# Altium project hjz-mitosis.PrjPcb
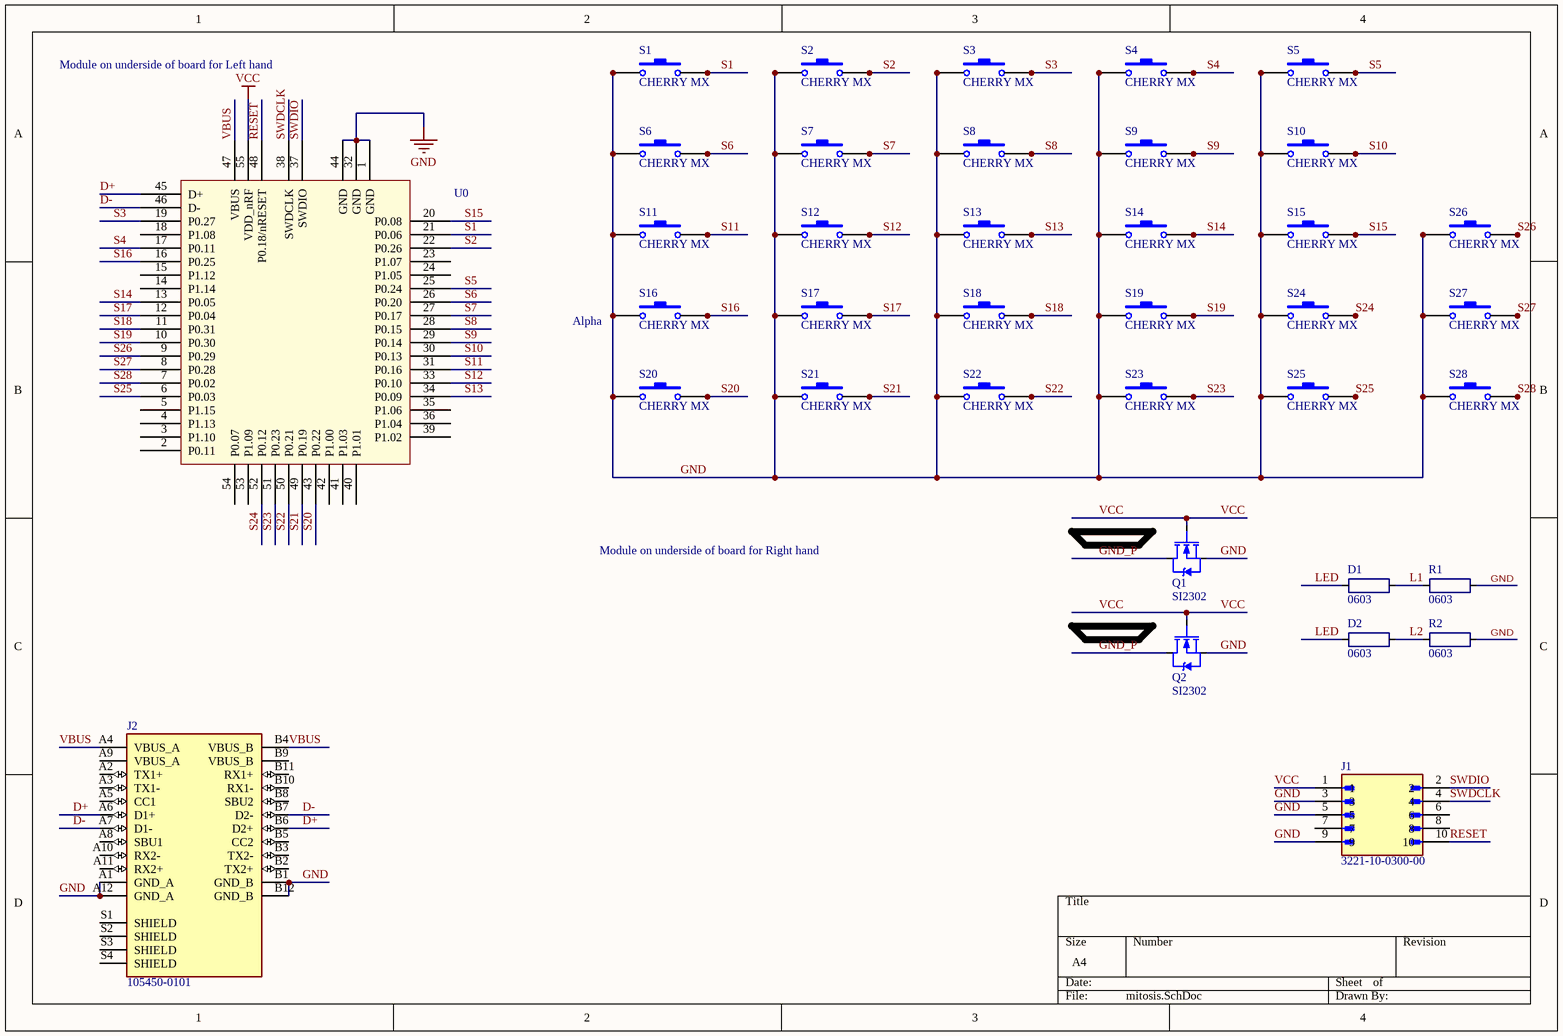
[diagram p0: mitosis.SchDoc]
1 sheet, 37 parts. Net scope: global (net labels, ports and power ports of the same name join across sheets).
Board files: mitosis.PcbDoc, mitosis_dev.PcbDoc

## Sheet mitosis.SchDoc
size A4

### Parts
D1  0603  [RESC2012X06N]
D2  0603  [RESC2012X06N]
J1  3221-10-0300-00  [CNC_3221-10-0300-00]
J2  105450-0101  [MOLEX_105450-0101]
Q1  SI2302  [SOT-23]
Q2  SI2302  [SOT-23]
R1  0603  [RESC2012X06N]
R2  0603  [RESC2012X06N]
S1  CHERRY MX  [cherry]
S2  CHERRY MX  [cherry]
S3  CHERRY MX  [cherry]
S4  CHERRY MX  [cherry]
S5  CHERRY MX  [cherry]
S6  CHERRY MX  [cherry]
S7  CHERRY MX  [cherry]
S8  CHERRY MX  [cherry]
S9  CHERRY MX  [cherry]
S10  CHERRY MX  [cherry]
S11  CHERRY MX  [cherry]
S12  CHERRY MX  [cherry]
S13  CHERRY MX  [cherry]
S14  CHERRY MX  [cherry]
S15  CHERRY MX  [cherry]
S16  CHERRY MX  [cherry]
S17  CHERRY MX  [cherry]
S18  CHERRY MX  [cherry]
S19  CHERRY MX  [cherry]
S20  CHERRY MX  [cherry]
S21  CHERRY MX  [cherry]
S22  CHERRY MX  [cherry]
S23  CHERRY MX  [cherry]
S24  CHERRY MX  [cherry]
S25  CHERRY MX  [cherry]
S26  CHERRY MX  [cherry]
S27  CHERRY MX  [cherry]
S28  CHERRY MX  [cherry]
U0  Core52840 (B)  [Core52840]  (value not drawn)

### Nets
GND: J1.3 J1.5 J1.9 J2.A1(GND_A) J2.A12(GND_A) J2.B1(GND_B) J2.B12(GND_B) Q1.2(S) Q2.2(S) R1.1 R2.1 S1.1 S1.3 S1.5 S1.7 S1.9 S1.11 S2.1 S2.3 S2.5 S2.7 S2.9 S2.11 S3.1 S3.3 S3.5 S3.7 S3.9 S3.11 S4.1 S4.3 S4.5 S4.7 S4.9 S4.11 S5.1 S5.3 S5.5 S5.7 S5.9 S5.11 S6.1 S6.3 S6.5 S6.7 S6.9 S6.11 S7.1 S7.3 S7.5 S7.7 S7.9 S7.11 S8.1 S8.3 S8.5 S8.7 S8.9 S8.11 S9.1 S9.3 S9.5 S9.7 S9.9 S9.11 S10.1 S10.3 S10.5 S10.7 S10.9 S10.11 S11.1 S11.3 S11.5 S11.7 S11.9 S11.11 S12.1 S12.3 S12.5 S12.7 S12.9 S12.11 S13.1 S13.3 S13.5 S13.7 S13.9 S13.11 S14.1 S14.3 S14.5 S14.7 S14.9 S14.11 S15.1 S15.3 S15.5 S15.7 S15.9 S15.11 S16.1 S16.3 S16.5 S16.7 S16.9 S16.11 S17.1 S17.3 S17.5 S17.7 S17.9 S17.11 S18.1 S18.3 S18.5 S18.7 S18.9 S18.11 S19.1 S19.3 S19.5 S19.7 S19.9 S19.11 S20.1 S20.3 S20.5 S20.7 S20.9 S20.11 S21.1 S21.3 S21.5 S21.7 S21.9 S21.11 S22.1 S22.3 S22.5 S22.7 S22.9 S22.11 S23.1 S23.3 S23.5 S23.7 S23.9 S23.11 S24.1 S24.3 S24.5 S24.7 S24.9 S24.11 S25.1 S25.3 S25.5 S25.7 S25.9 S25.11 S26.1 S26.3 S26.5 S26.7 S26.9 S26.11 S27.1 S27.3 S27.5 S27.7 S27.9 S27.11 S28.1 S28.3 S28.5 S28.7 S28.9 S28.11 U0.1(GND) U0.32(GND) U0.44(GND)
VCC: J1.1 Q1.1(G) Q2.1(G) U0.55(VDD_nRF)
D+: J2.A6(D1+) J2.B6(D2+) U0.45(D+)
D-: J2.A7(D1-) J2.B7(D2-) U0.46(D-)
GND_P: Q1.3(D) Q2.3(D)
L1: D1.1 R1.2
L2: D2.1 R2.2
LED: D1.2 D2.2
RESET: J1.10 U0.48(P0.18/nRESET)
S1: S1.2 S1.4 S1.6 S1.8 S1.10 S1.12 U0.21(P0.06)
S2: S2.2 S2.4 S2.6 S2.8 S2.10 S2.12 U0.22(P0.26)
S3: S3.2 S3.4 S3.6 S3.8 S3.10 S3.12 U0.19(P0.27)
S4: S4.2 S4.4 S4.6 S4.8 S4.10 S4.12 U0.17(P0.11)
S5: S5.2 S5.4 S5.6 S5.8 S5.10 S5.12 U0.25(P0.24)
S6: S6.2 S6.4 S6.6 S6.8 S6.10 S6.12 U0.26(P0.20)
S7: S7.2 S7.4 S7.6 S7.8 S7.10 S7.12 U0.27(P0.17)
S8: S8.2 S8.4 S8.6 S8.8 S8.10 S8.12 U0.28(P0.15)
S9: S9.2 S9.4 S9.6 S9.8 S9.10 S9.12 U0.29(P0.14)
S10: S10.2 S10.4 S10.6 S10.8 S10.10 S10.12 U0.30(P0.13)
S11: S11.2 S11.4 S11.6 S11.8 S11.10 S11.12 U0.31(P0.16)
S12: S12.2 S12.4 S12.6 S12.8 S12.10 S12.12 U0.33(P0.10)
S13: S13.2 S13.4 S13.6 S13.8 S13.10 S13.12 U0.34(P0.09)
S14: S14.2 S14.4 S14.6 S14.8 S14.10 S14.12 U0.13(P0.05)
S15: S15.2 S15.4 S15.6 S15.8 S15.10 S15.12 U0.20(P0.08)
S16: S16.2 S16.4 S16.6 S16.8 S16.10 S16.12 U0.16(P0.25)
S17: S17.2 S17.4 S17.6 S17.8 S17.10 S17.12 U0.12(P0.04)
S18: S18.2 S18.4 S18.6 S18.8 S18.10 S18.12 U0.11(P0.31)
S19: S19.2 S19.4 S19.6 S19.8 S19.10 S19.12 U0.10(P0.30)
S20: S20.2 S20.4 S20.6 S20.8 S20.10 S20.12 U0.43(P0.22)
S21: S21.2 S21.4 S21.6 S21.8 S21.10 S21.12 U0.49(P0.19)
S22: S22.2 S22.4 S22.6 S22.8 S22.10 S22.12 U0.50(P0.21)
S23: S23.2 S23.4 S23.6 S23.8 S23.10 S23.12 U0.51(P0.23)
S24: S24.2 S24.4 S24.6 S24.8 S24.10 S24.12 U0.52(P0.12)
S25: S25.2 S25.4 S25.6 S25.8 S25.10 S25.12 U0.6(P0.03)
S26: S26.2 S26.4 S26.6 S26.8 S26.10 S26.12 U0.9(P0.29)
S27: S27.2 S27.4 S27.6 S27.8 S27.10 S27.12 U0.8(P0.28)
S28: S28.2 S28.4 S28.6 S28.8 S28.10 S28.12 U0.7(P0.02)
SWDCLK: J1.4 U0.38(SWDCLK)
SWDIO: J1.2 U0.37(SWDIO)
VBUS: J2.A4(VBUS_A) J2.B4(VBUS_B) U0.47(VBUS)

Not connected (* = marked no-connect by the designer): J1 6 7 8; J2 A2(TX1+) A3(TX1-) A5(CC1) A8(SBU1) A9(VBUS_A) A10(RX2-) A11(RX2+) B2(TX2+) B3(TX2-) B5(CC2) B8(SBU2) B9(VBUS_B) B10(RX1-) B11(RX1+) S1(SHIELD) S2(SHIELD) S3(SHIELD) S4(SHIELD); U0 2(P0.11) 3(P1.10) 4(P1.13) 5(P1.15) 14(P1.14) 15(P1.12) 18(P1.08) 23(P1.07) 24(P1.05) 35(P1.06) 36(P1.04) 39(P1.02) 40(P1.01) 41(P1.03) 42(P1.00) 53(P1.09) 54(P0.07)

### Notes on the sheet
- Module on underside of board for Left hand
- (near S16) Alpha
- Module on underside of board for Right hand

### Library data of the parts
J1 = 3221-10-0300-00: Conn Shrouded Header HDR 10 POS 1.27mm Solder ST SMD T/R; Manufacturer Part Number: 3221-10-0300-00-TR; MF: CNC Tech; Package: None; Check_prices: https://www.snapeda.com/parts/3221-10-0300-00/CNC+Tech/view-part/?ref=eda; Value: *; MP: 3221-10-0300-00; Availability: In Stock; Purchase-URL: https://pricing.snapeda.com/search/part/3221-10-0300-00/?ref=eda; SnapEDA_Link: https://www.snapeda.com/parts/3221-10-0300-00/CNC+Tech/view-part/?ref=snap; Price: None; Supplier: Digi-Key; Supplier Part Number: 1175-2649-6-ND; Manufacturer: CNC Tech; RoHS: No; Category: Connectors; Stock: 84321; Pricing: 1=0.94000, 10=0.79200, 100=0.71100 (USD)
J2 = 105450-0101: Conn USB 3.1 Type C F 24 POS Solder RA SMD 24 Terminal 1 Port USB 3.1 T/R; Manufacturer: Molex; Number of Terminals/Pins: 24; Gender: Receptacle; Number of Ports: 1; Mating Cycles: 10000; Shielding: Shielded; Current Rating: 5A; USB Standard: USB 3.1; Pitch: 0.5mm; Package: None; Availability: Unavailable; Value: *; MP: 105450-0101; Price: None; Supplier: Newark; Supplier Part Number: 33AC7773; Manufacturer Part Number: 105450-0101; RoHS: Yes; Category: USB Connectors; Stock: 13000; Pricing: 1=1.67000, 1300=1.65000, 2600=1.61000 (USD); Mounting Technology: Surface Mount,Horizontal,Through Hole; Case/Package: 0101; Pins: 24; Contact Plating: Gold; Insulation Color: Black; Contact Material: Copper Alloy; Housing Material: Thermoplastic; Min Operating Temperature: -30°C; Max Operating Temperature: 85°C; Packaging: Tape and Reel; Connector Type: USB; Number of Contacts: 24; Termination: Solder; Orientation: Right Angle; Features: Shielded; Series: -; Length: 8.94mm; RoHS Compliant: Yes; Flammability Rating: UL94 V-0; ComponentLink1URL: http://www.farnell.com/datasheets/2801634.pdf?src-supplier=Farnell; ComponentLink1Description: http://www.farnell.com/datasheets/2801634.pdf?src-supplier=Farnell; ComponentLink2URL: http://www.literature.molex.com/SQLImages/kelmscott/Molex/PDF_Images/987651-4081.PDF?src-supplier=Avnet; ComponentLink2Description: http://www.literature.molex.com/SQLImages/kelmscott/Molex/PDF_Images/987651-4081.PDF?src-supplier=Avnet; ComponentLink3URL: http://www.farnell.com/datasheets/2672741.pdf?src-supplier=Newark; ComponentLink3Description: http://www.farnell.com/datasheets/2672741.pdf?src-supplier=Newark; ComponentLink4URL: http://www.farnell.com/datasheets/2801634.pdf?src-supplier=Newark; ComponentLink4Description: http://www.farnell.com/datasheets/2801634.pdf?src-supplier=Newark; ComponentLink5URL: https://www.molex.com/pdm_docs/ps/PS-105448-001.pdf?src-supplier=Digi-Key; ComponentLink5Description: https://www.molex.com/pdm_docs/ps/PS-105448-001.pdf?src-supplier=Digi-Key; ComponentLink6URL: https://www.molex.com/pdm_docs/sd/1054500101_sd.pdf?src-supplier=Digi-Key; ComponentLink6Description: https://www.molex.com/pdm_docs/sd/1054500101_sd.pdf?src-supplier=Digi-Key; ComponentLink7URL: http://www.farnell.com/datasheets/2801634.pdf?src-supplier=Element14; ComponentLink7Description: http://www.farnell.com/datasheets/2801634.pdf?src-supplier=Element14; ComponentLink8URL: http://www.farnell.com/datasheets/2015275.pdf?src-supplier=Element14; ComponentLink8Description: http://www.farnell.com/datasheets/2015275.pdf?src-supplier=Element14
Q1 Q2 = SI2302: N-Channel Logic MOSFET; Note: Pin 2 is electrically connected to pin 4.; Published: 8-Jun-2000; LatestRevisionDate: 17-Jul-2002; LatestRevisionNote: Re-released for DXP Platform.; DatasheetVersion: PD-9.814; PackageVersion: Feb-1997; PackageReference: TO-220AB; Publisher: Altium Limited; PackageDescription: TO, Thru-Hole, Vertical, Heatsink Mounted; 3 In-Line Leads; Pitch 2.54 mm; ComponentLink1Description: Manufacturer Link; ComponentLink1URL: http://www.irf.com/
S1-S28 = CHERRY MX: Switch; Published: 24-Mar-1999; LatestRevisionDate: 17-Jul-2002; LatestRevisionNote: Re-released for DXP Platform.; PackageReference: SPST-2; Publisher: Altium Limited; PackageDescription: Switch; 2 Leads
U0 = Core52840 (B): NRF52840 (B)